# Altium project picr22RobodendronMainboard.PrjPcb
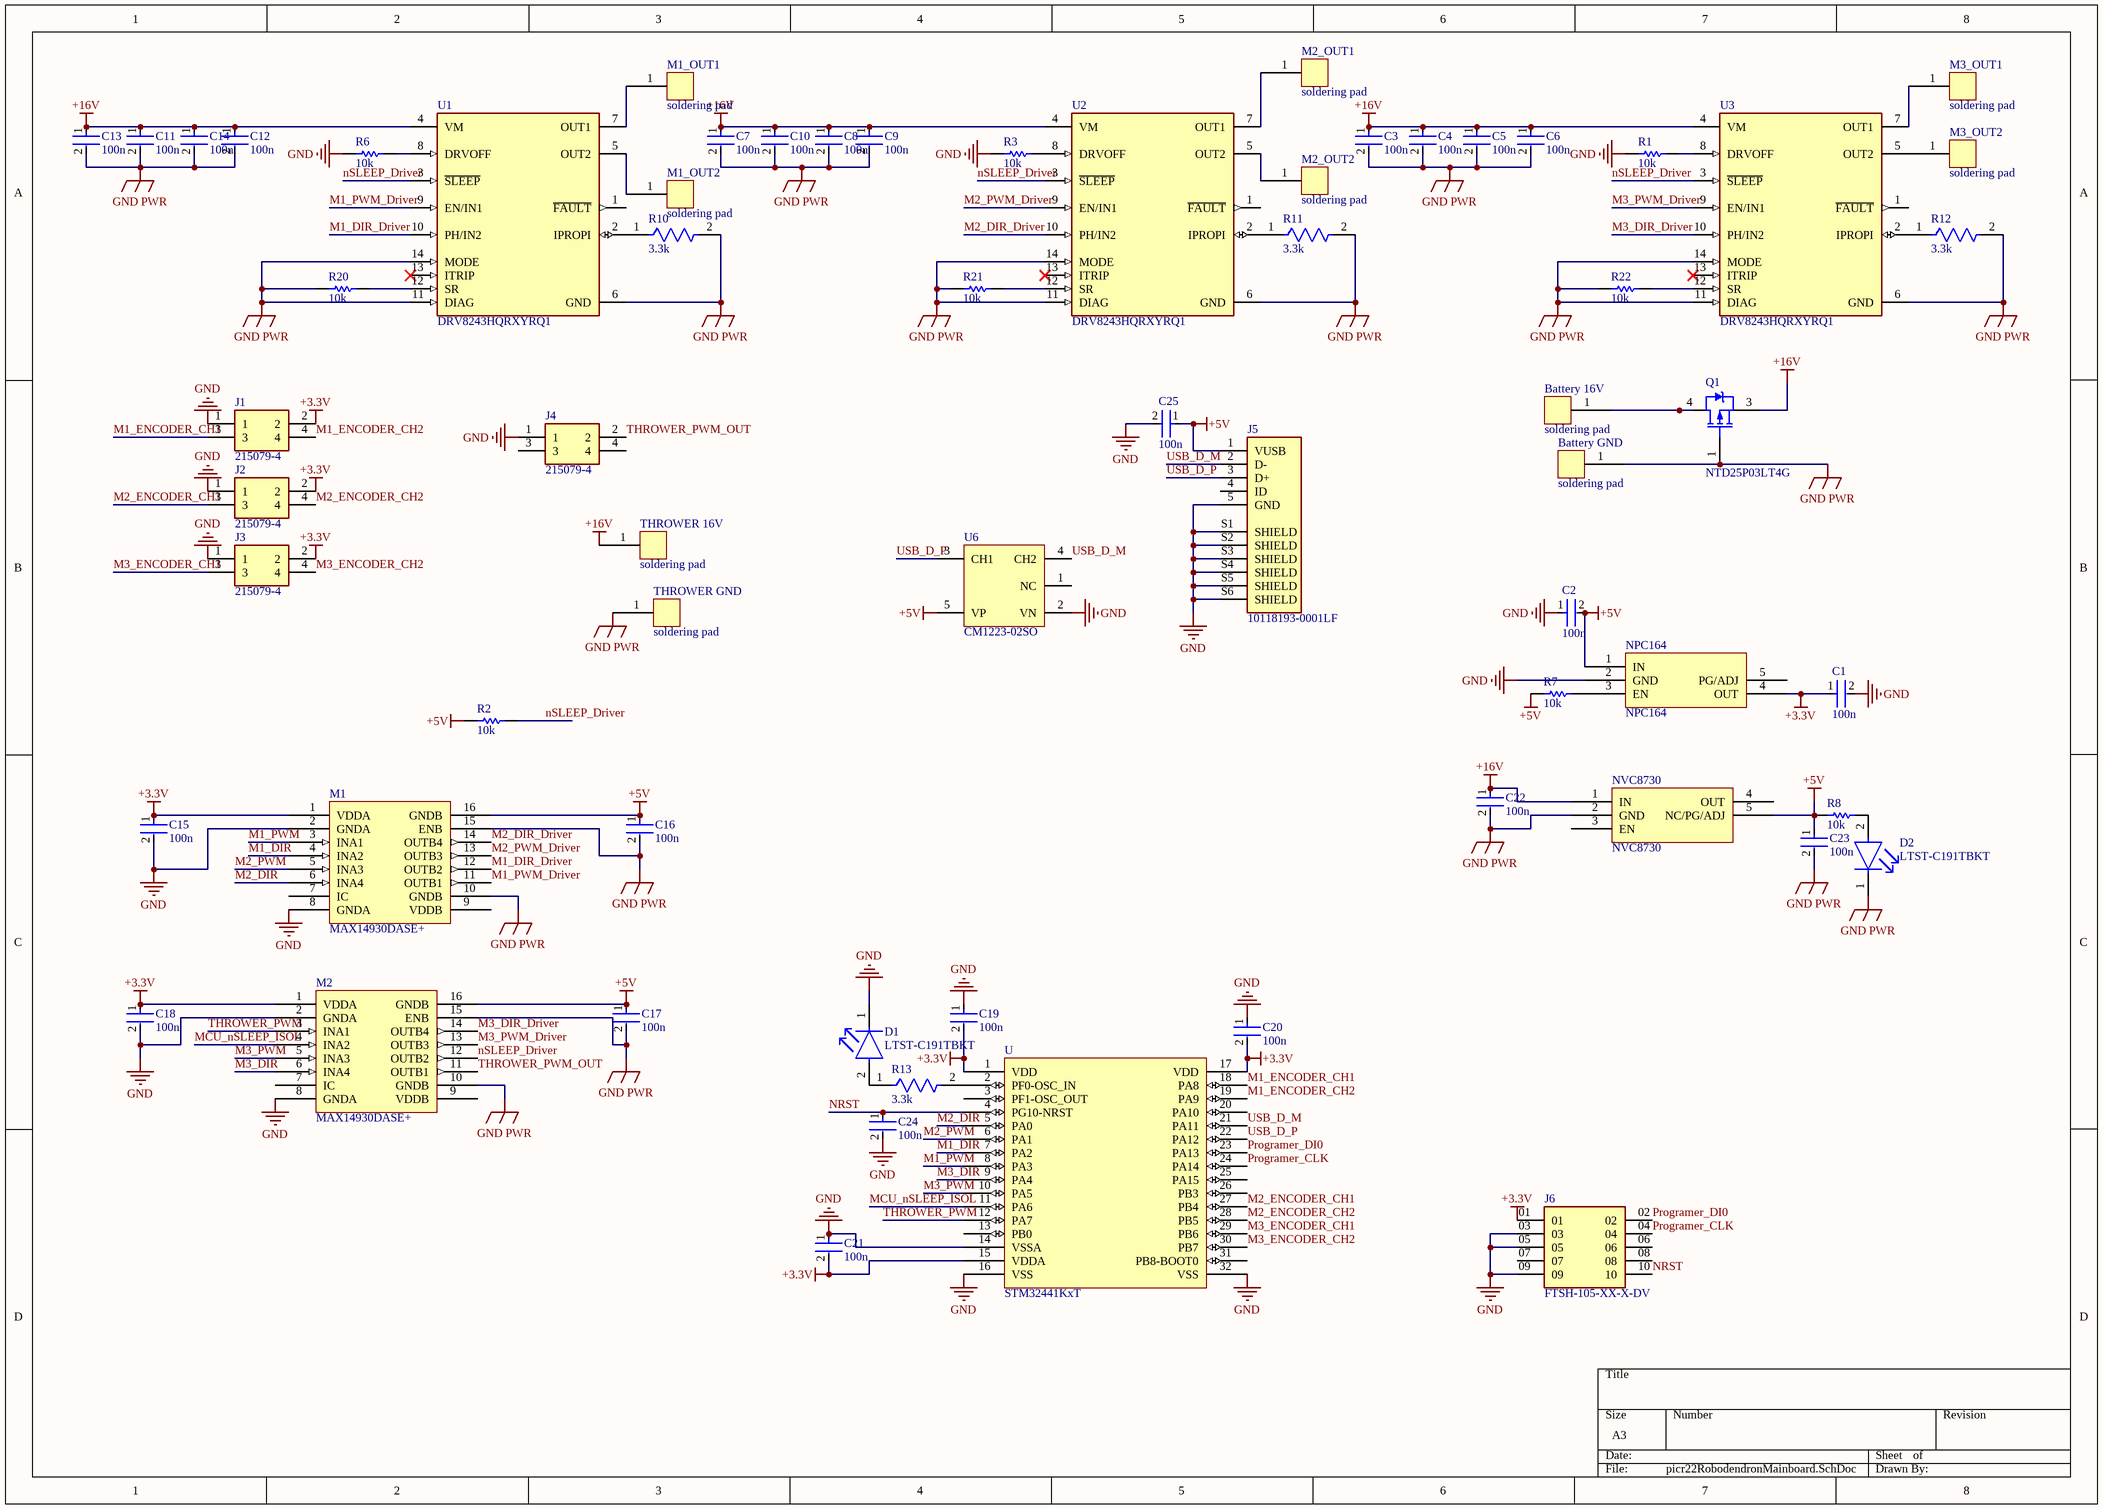
[diagram p0: picr22RobodendronMainboard.SchDoc]
1 sheet, 66 parts. Net scope: global (net labels, ports and power ports of the same name join across sheets).
Board file: picr22RobodendronMainboard.PcbDoc

## Sheet picr22RobodendronMainboard.SchDoc
size A3; SheetNumber: 1; SheetTotal: 1

### Parts
Battery_16V  soldering pad  [PCBComponent_1]
Battery_GND  soldering pad  [PCBComponent_1]
C1  100n  [FP-CGA3E-0_3-0_1-IPC_A]
C2  100n  [FP-CGA3E-0_3-0_1-IPC_A]
C3  100n  [FP-CGA3E-0_3-0_1-IPC_A]
C4  100n  [FP-CGA3E-0_3-0_1-IPC_A]
C5  100n  [FP-CGA3E-0_3-0_1-IPC_A]
C6  100n  [FP-CGA3E-0_3-0_1-IPC_A]
C7  100n  [FP-CGA3E-0_3-0_1-IPC_A]
C8  100n  [FP-CGA3E-0_3-0_1-IPC_A]
C9  100n  [FP-CGA3E-0_3-0_1-IPC_A]
C10  100n  [FP-CGA3E-0_3-0_1-IPC_A]
C11  100n  [FP-CGA3E-0_3-0_1-IPC_A]
C12  100n  [FP-CGA3E-0_3-0_1-IPC_A]
C13  100n  [FP-CGA3E-0_3-0_1-IPC_A]
C14  100n  [FP-CGA3E-0_3-0_1-IPC_A]
C15  100n  [FP-CGA3E-0_3-0_1-IPC_A]
C16  100n  [FP-CGA3E-0_3-0_1-IPC_A]
C17  100n  [FP-CGA3E-0_3-0_1-IPC_A]
C18  100n  [FP-CGA3E-0_3-0_1-IPC_A]
C19  100n  [FP-CGA3E-0_3-0_1-IPC_A]
C20  100n  [FP-CGA3E-0_3-0_1-IPC_A]
C21  100n  [FP-CGA3E-0_3-0_1-IPC_A]
C22  100n  [FP-CGA3E-0_3-0_1-IPC_A]
C23  100n  [FP-CGA3E-0_3-0_1-IPC_A]
C24  100n  [FP-CGA3E-0_3-0_1-IPC_A]
C25  100n  [FP-CGA3E-0_3-0_1-IPC_A]
D1  LTST-C191TBKT  [FP-LTST-C191TBKT-MFG]
D2  LTST-C191TBKT  [FP-LTST-C191TBKT-MFG]
J1  215079-4  [TE_215079-4]
J2  215079-4  [TE_215079-4]
J3  215079-4  [TE_215079-4]
J4  215079-4  [TE_215079-4]
J5  10118193-0001LF  [FCI_10118193-0001LF]
J6  FTSH-105-XX-X-DV  [SAMTEC_FTSH-105-XX-X-DV]
M1  MAX14930DASE+  [SOIC127P600X175-16N]
M1_OUT1  soldering pad  [PCBComponent_1]
M1_OUT2  soldering pad  [PCBComponent_1]
M2  MAX14930DASE+  [SOIC127P600X175-16N]
M2_OUT1  soldering pad  [PCBComponent_1]
M2_OUT2  soldering pad  [PCBComponent_1]
M3_OUT1  soldering pad  [PCBComponent_1]
M3_OUT2  soldering pad  [PCBComponent_1]
NPC164  NPC164  [TSOP95P280X110-5N]
NVC8730  NVC8730  [TSOP95P280X110-6N]
Q1  NTD25P03LT4G  [ONSC-DPAK-3-369C-01_V]
R1  10k  [RESC1609X50X30NL8T20]
R2  10k  [RESC1609X50X30NL8T20]
R3  10k  [RESC1609X50X30NL8T20]
R6  10k  [RESC1609X50X30NL8T20]
R7  10k  [RESC1609X50X30NL8T20]
R8  10k  [RESC1609X50X30NL8T20]
R10  3.3k  [FP-ERA3A-IPC_B]
R11  3.3k  [FP-ERA3A-IPC_B]
R12  3.3k  [FP-ERA3A-IPC_B]
R13  3.3k  [FP-ERA3A-IPC_B]
R20  10k  [RESC1609X50X30NL8T20]
R21  10k  [RESC1609X50X30NL8T20]
R22  10k  [RESC1609X50X30NL8T20]
THROWER_16V  soldering pad  [PCBComponent_1]
THROWER_GND  soldering pad  [PCBComponent_1]
U  STM32441KxT  [TQFP80P890X890X160-32N]
U1  DRV8243HQRXYRQ1  [FP-RXY0014A-MFG]
U2  DRV8243HQRXYRQ1  [FP-RXY0014A-MFG]
U3  DRV8243HQRXYRQ1  [FP-RXY0014A-MFG]
U6  CM1223-02SO  [ONSC-SOT23-5-527AH-01_L]

### Nets
+3.3V: C1.1 C15.1 C18.1 C19.2 C20.2 C21.2 J1.2 J2.2 J3.2 J6.01 M1.1(VDDA) M2.1(VDDA) NPC164.4(OUT) U.1(VDD) U.15(VDDA) U.17(VDD)
+5V: C2.2 C16.1 C17.1 C23.1 C25.1 J5.1(VUSB) M1.16(GNDB) M2.16(GNDB) NPC164.1(IN) NVC8730.5(NC/PG/ADJ) R2.1 R7.1 R8.1 U6.5(VP)
+16V: C3.1 C4.1 C5.1 C6.1 C7.1 C8.1 C9.1 C10.1 C11.1 C12.1 C13.1 C14.1 C22.1 NVC8730.1(IN) Q1.3(S) THROWER_16V.1 U1.4(VM) U2.4(VM) U3.4(VM)
GND: C1.2 C2.1 C15.2 C18.2 C19.1 C20.1 C21.1 C24.2 C25.2 D1.1(C) J1.1 J2.1 J3.1 J4.1 J5.5(GND) J5.S1(SHIELD) J5.S2(SHIELD) J5.S3(SHIELD) J5.S4(SHIELD) J5.S5(SHIELD) J5.S6(SHIELD) J6.03 J6.05 J6.09 M1.2(GNDA) M1.8(GNDA) M2.2(GNDA) M2.8(GNDA) NPC164.2(GND) R1.1 R3.1 R6.1 U.14(VSSA) U.16(VSS) U.32(VSS) U6.2(VN)
GND PWR: Battery_GND.1 C3.2 C4.2 C5.2 C6.2 C7.2 C8.2 C9.2 C10.2 C11.2 C12.2 C13.2 C14.2 C16.2 C17.2 C22.2 C23.2 D2.1(C) M1.10(GNDB) M1.15(ENB) M2.10(GNDB) M2.15(ENB) NVC8730.2(GND) Q1.1(G) R10.2 R11.2 R12.2 R20.1 R21.1 R22.1 THROWER_GND.1 U1.6(GND) U1.11(DIAG) U1.14(MODE) U2.6(GND) U2.11(DIAG) U2.14(MODE) U3.6(GND) U3.11(DIAG) U3.14(MODE)
M1_DIR: M1.4(INA2) U.7(PA2)
M1_DIR_Driver: M1.12(OUTB2) U1.10(PH/IN2)
M1_ENCODER_CH1: J1.3 U.18(PA8)
M1_ENCODER_CH2: J1.4 U.19(PA9)
M1_PWM: M1.3(INA1) U.8(PA3)
M1_PWM_Driver: M1.11(OUTB1) U1.9(EN/IN1)
M2_DIR: M1.6(INA4) U.5(PA0)
M2_DIR_Driver: M1.14(OUTB4) U2.10(PH/IN2)
M2_ENCODER_CH1: J2.3 U.27(PB4)
M2_ENCODER_CH2: J2.4 U.28(PB5)
M2_PWM: M1.5(INA3) U.6(PA1)
M2_PWM_Driver: M1.13(OUTB3) U2.9(EN/IN1)
M3_DIR: M2.6(INA4) U.9(PA4)
M3_DIR_Driver: M2.14(OUTB4) U3.10(PH/IN2)
M3_ENCODER_CH1: J3.3 U.29(PB6)
M3_ENCODER_CH2: J3.4 U.30(PB7)
M3_PWM: M2.5(INA3) U.10(PA5)
M3_PWM_Driver: M2.13(OUTB3) U3.9(EN/IN1)
MCU_nSLEEP_ISOL: M2.4(INA2) U.11(PA6)
NRST: C24.1 J6.10 U.4(PG10-NRST)
nSLEEP_Driver: M2.12(OUTB2) R2.2 U1.3(~{SLEEP}) U2.3(~{SLEEP}) U3.3(~{SLEEP})
Programer_CLK: J6.04 U.24(PA14)
Programer_DI0: J6.02 U.23(PA13)
THROWER_PWM: M2.3(INA1) U.12(PA7)
THROWER_PWM_OUT: J4.2 M2.11(OUTB1)
USB_D_M: J5.2(D-) U.21(PA11) U6.4(CH2)
USB_D_P: J5.3(D+) U.22(PA12) U6.3(CH1)
NetBattery_16V_1: Battery_16V.1 Q1.4(D)
NetD1_2: D1.2(A) R13.1
NetD2_2: D2.2(A) R8.2
NetM1_OUT1_1: M1_OUT1.1 U1.7(OUT1)
NetM1_OUT2_1: M1_OUT2.1 U1.5(OUT2)
NetM2_OUT1_1: M2_OUT1.1 U2.7(OUT1)
NetM2_OUT2_1: M2_OUT2.1 U2.5(OUT2)
NetM3_OUT1_1: M3_OUT1.1 U3.7(OUT1)
NetM3_OUT2_1: M3_OUT2.1 U3.5(OUT2)
NetNPC164_3: NPC164.3(EN) R7.2
NetR1_2: R1.2 U3.8(DRVOFF)
NetR3_2: R3.2 U2.8(DRVOFF)
NetR6_2: R6.2 U1.8(DRVOFF)
NetR10_1: R10.1 U1.2(IPROPI)
NetR11_1: R11.1 U2.2(IPROPI)
NetR12_1: R12.1 U3.2(IPROPI)
NetR13_2: R13.2 U.2(PF0-OSC_IN)
NetR20_2: R20.2 U1.12(SR)
NetR21_2: R21.2 U2.12(SR)
NetR22_2: R22.2 U3.12(SR)

Not connected (* = marked no-connect by the designer): J4 3 4; J5 4(ID); J6 06 07 08; M1 7(IC) 9(VDDB); M2 7(IC) 9(VDDB); NPC164 5(PG/ADJ); NVC8730 3(EN) 4(OUT); U 3(PF1-OSC_OUT) 13(PB0) 20(PA10) 25(PA15) 26(PB3) 31(PB8-BOOT0); U1 1(~{FAULT}) 13(ITRIP)*; U2 1(~{FAULT}) 13(ITRIP)*; U3 1(~{FAULT}) 13(ITRIP)*; U6 1(NC)

### Library data of the parts
C1-C25 = CMP-2000-07546-2: Cap Ceramic 100nF 50V X7R 10% Pad SMD 0603 +125°C Automotive T/R; Weight: 7.1E-05oz; Composition: Ceramic; Max Operating Temperature: 125°C; Termination: SMD/SMT; Dielectric: X7R; Length: 1.6mm; Package Quantity: 1; REACH SVHC: No SVHC; Lead Free: Lead Free; Case Code (Metric): 1608; Min Operating Temperature: -55°C; Packaging: Tape and Reel; Tolerance: 10%; Voltage Rating: 50V; Case Code (Imperial): 0603; Capacitance: 100nF; Case/Package: 0603; Voltage Rating (DC): 50V; Depth: 0.8mm; Radiation Hardening: No; Ratings: AEC-Q200; Mount: Surface Mount; Voltage: 50V; Thickness: 0.035inch; Width: 0.8mm; Height: 0.8mm
D1 D2 = CMP-22017-000008-1: LED BLUE CLEAR CHIP SMD; Lens Color: Colorless; Dominant Wavelength: 475nm; Forward Current: 20mA; Wavelength: 468nm; Viewing Angle: 130°; Power Dissipation: 76mW; Luminous Intensity: 180mcd; Reverse Voltage: 5V; Number of Elements: 1; Lens Style: Diffused; Forward Voltage: 3.8V; Max Power Dissipation: 75mW; Case Code (Metric): 1608; Packaging: Tape and Reel; Case/Package: 0603; Depth: 1.6mm; Mount: Surface Mount; Lead Free: Lead Free; Min Operating Temperature: -20°C; Lens Transparency: Clear; Illumination Color: Blue; Height: 0.55mm; Test Current: 20mA; Case Code (Imperial): 0603; Max Operating Temperature: 80°C; Number of Pins: 2; Length: 0.8mm; Radiation Hardening: No; Package Quantity: 1; Number of LEDs: 1; Width: 0.8mm; Color: Blue
J1-J4 = 215079-4: 4 Position Receptacle Connector Through Hole; MF: TE Connectivity; Price: None; Availability: Unavailable; SnapEDA_Link: https://www.snapeda.com/parts/215079-4/TE%20Connectivity%20AMP%20Connectors/view-part/2366486/?ref=snap; EU_RoHS_Compliance: Compliant; Value: *; MP: 215079-4; TE_purchase_URL: https://www.te.com/usa-en/product-215079-4.html?te_bu=Cor&te_type=disp&te_campaign=seda_glo_cor-seda-global-disp-prtnr-fy19-seda-model-bom-cta_sma-317_1&elqCampaignId=32493; Package: SMD-6 Omron Electronics
J5 = 10118193-0001LF: USB - micro B USB 2.0 Receptacle Connector 5 Position Surface Mount, Right Angle; Through Hole; MF: Amphenol ICC; Availability: Unavailable; SnapEDA_Link: https://www.snapeda.com/parts/10118193-0001LF/Amphenol%20FCI/view-part/2758989/?ref=snap; MP: 10118193-0001LF; Price: None; Value: *; Package: None
J6 = FTSH-105-XX-X-DV: Connector Header Surface Mount 10 position 0.050" (1.27mm); Availability: Unavailable; Package: None; MP: FTSH-105-XX-X-DV; Price: None; Value: *
Q1 = CMP-1058-00409-1: Power MOSFET, -25 A, -30 V, Logic Level P-Channel, 3-Pin DPAK, Pb-Free, Tape and Reel; Manufacturer: On Semiconductor; Coss Typ (pF): 290; Crss Typ (pF): 105; V(BR)DSS Min (V): 30; VGS Max (V): 15; PD Max (W): 75; Ciss Typ (pF): 900; ID Max (A): 25; Qrr Typ (nC): 35; Configuration: Single; Channel Polarity: P Channel; VGS(th) Max (V): 2; Mounting Technology: Surface Mount; ComponentLink2Description: Datasheet; ComponentLink3URL: http://www.onsemi.cn/pub_link/Collateral/369C.PDF; ComponentLink1Description: Manufacturer URL; ComponentLink3Description: Package Specification; Packing: Tape and Reel; DatasheetVersion: Rev. 4; PackageDescription: 3-Pin Flange Mount, Body 6.54 x 6.095 mm, Pitch 2.29 mm; ComponentLink2URL: http://www.onsemi.cn/pub_link/Collateral/NTD25P03L-D.PDF; PackageReference: DPAK-3-369C-01; Package Type: DPAK-3; PackageVersion: Rev. E, 02/2014; ComponentLink1URL: http://www.onsemi.com/; RoHS: Pb-Free; PartNumber: NTD25P03LT4G
R1-R3 R6-R8 R20-R22 = CMP-1666-00005-4: Chip Resistor, 10 KOhm, +/- 1%, 100 mW, -55 to 155 degC, 0603 (1608 Metric), RoHS, Tape and Reel; Manufacturer: Vishay Semiconductor; Voltage Rating: 75 V; Max Operating Temperature: 155 degC; PackageDescription: 2-Pin Surface Mount Device, Body 1.575 x 0.85 mm; ComponentLink1Description: Manufacturer URL; RoHSCompliant: true; PackageReference: 0603; REACH SVHC: Unknown; Length: 1.55 mm; DatasheetVersion: 06/2012; Packaging: Tape and Reel; Min Operating Temperature: -55 degC; Mounting Technology: Surface Mount; ComponentLink2URL: https://datasheet.ciiva.com/11809/0900766b80d98afc-11809037.pdf; Height: 0.45 mm; ComponentLink2Description: Datasheet; Package Quantity: 5000; ComponentLink1URL: http://www.vishay.com/
R10-R13 = CMP-2000-00040-2: RES SMD 3.3K OHM 0.1% 1/10W 0603; Voltage Rating (DC): 75V; Power Rating: 100mW; Temperature Coefficient: 25ppm/°C; Resistance: 3.3kR; Package Quantity: 1; Width: 0.8mm; Construction: Rectangular; Case Code (Imperial): 0603; Radiation Hardening: No; Number of Terminations: 2; REACH SVHC: No SVHC; Height: 0.45mm; Voltage Rating: 75V; Max Power Dissipation: 100mW; Max Operating Temperature: 155°C; Resistor Type: Thin Film; Tolerance: 0.1%; Resistance Tolerance: 0.1%; Technology: METAL FILM; Depth: 0.8mm; Packaging: Tape and Reel; Termination: SMD/SMT; Mount: Surface Mount; Lead Free: Lead Free; Contact Plating: Tin; Min Operating Temperature: -55°C; Case Code (Metric): 1608; Military Standard: Not; Features: Automotive AEC-Q200; Length: 1.6mm; Case/Package: 0603; Number of Pins: 2; RoHS Compliant: Yes; Size Code: 0603; Series: ERA-3A
U = STM32441
U1-U3 = CMP-04915-000088-1: Automotive 40-V, 12-A H-Bridge driver with integrated current sensing and feedback 14-VQFN-HR -40 to 125
U6 = CMP-1063-00173-1: Industry First Low Capacitance ESD Protection Arrays with Backdrive Protection, 5-Pin SOT-23, Pb-Free, Tape and Reel; Manufacturer: On Semiconductor; Direction: Unidirectional; PPK Max (W): 0.225; C Max (pF): 1.5; Number of Lines: 2; ComponentLink1Description: Manufacturer URL; PackageReference: SOT23-5-527AH-01; ComponentLink3URL: http://www.onsemi.com/pub_link/Collateral/527AH.PDF; ComponentLink1URL: http://www.onsemi.com/; PackageDescription: 5-Pin Small Outline Transistor, Body 2.9 x 1.6 mm, Pitch 0.95 mm; ComponentLink2URL: http://www.onsemi.com/pub_link/Collateral/CM1223-D.PDF; PackageVersion: Rev. O, 12/2008; ComponentLink3Description: Package Specification; PartNumber: CM1223-02SO; DatasheetVersion: Rev. 6; RoHS: Pb-Free; Code_JEDEC: MO-178; ComponentLink2Description: Datasheet; Packing: Tape and Reel; Mounting Technology: Surface Mount